# EasyEDA Pro project ComBadge.eprj

# Schematic Schematic1
Create Date: 2022-11-26; Page Name: P1; Project Name: ComBadge; Schematic Name: Schematic1; Update Date: 2022-11-29; Company: EasyEDA.com; Drawed: DanDan; Page Size: A4; Part Number: CMBG-01; Reviewed: DanDan; Version: V0.1a
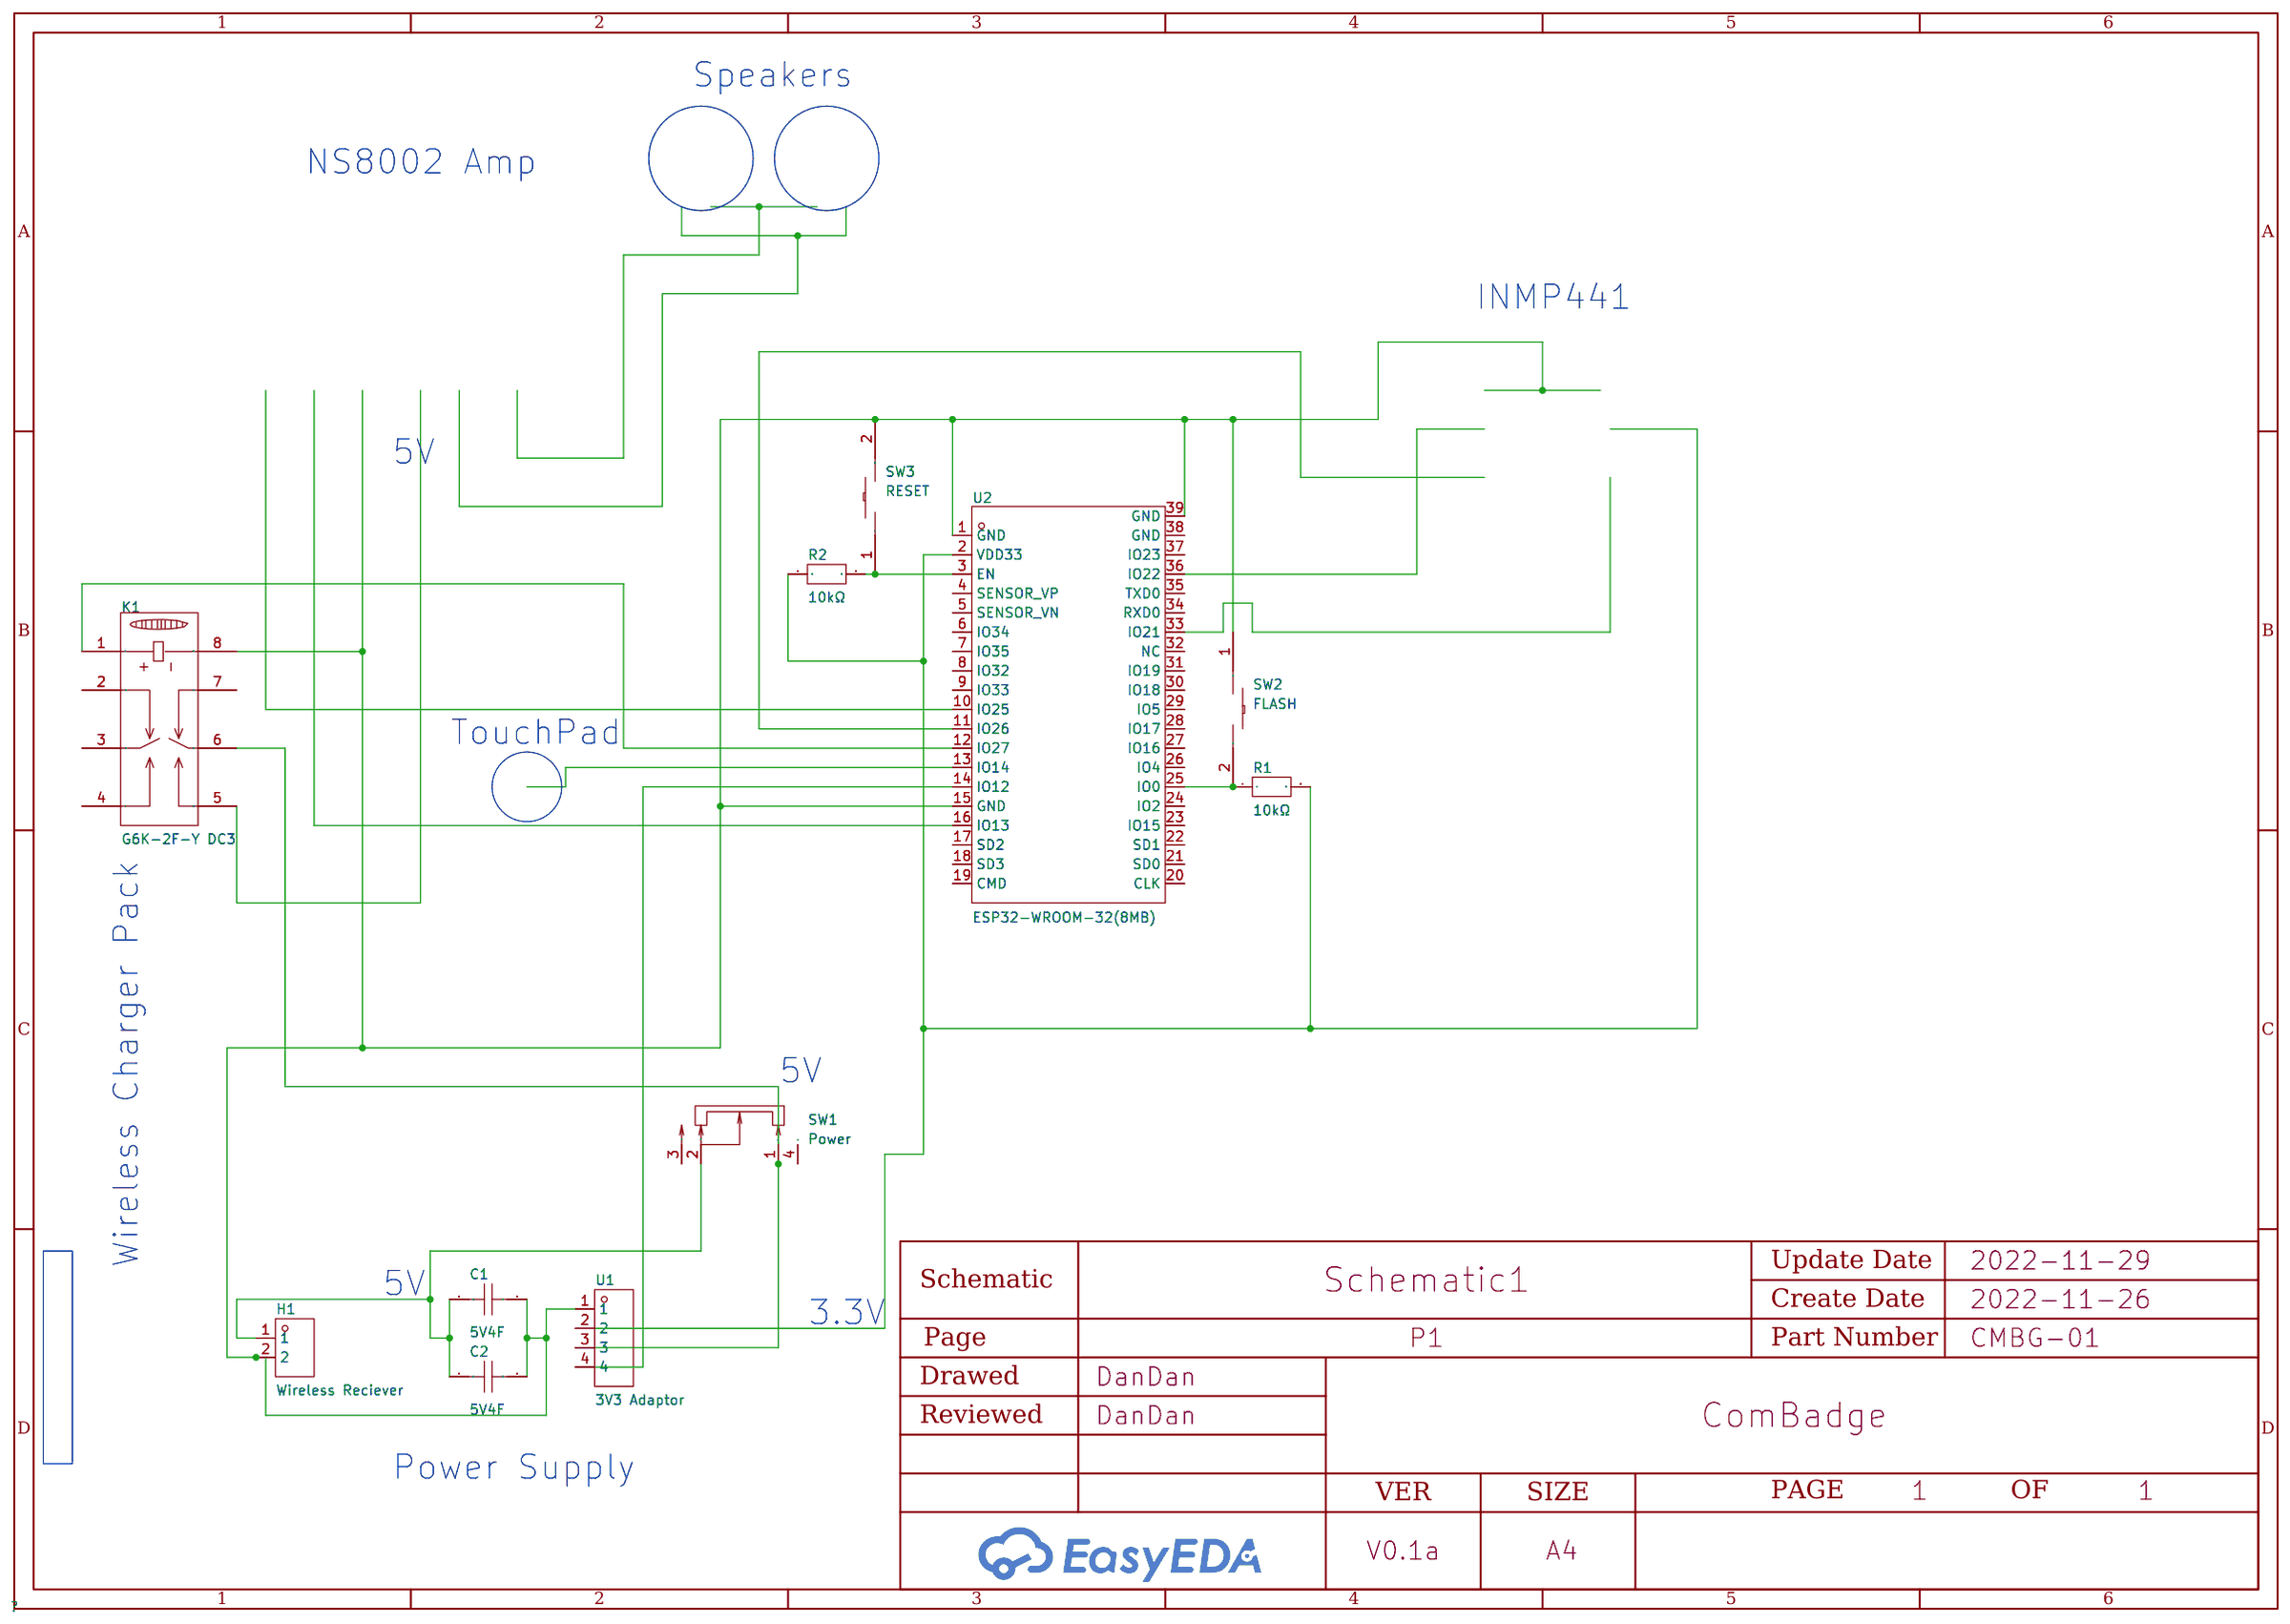
[diagram p0: schematic sheet]

## Parts
C1  4F  [C0805]
C2  100nF  [C0805]
H1  Wireless Reciever  [HDR-TH_2P-P2.00-V-M]
K1  G6K-2F-Y DC3  [RELAY-SMD_G6K-2F-Y]
R1  10kΩ  [R0402]
R2  10kΩ  [R0402]
SW1  Power  [SW-SMD_PCM12SMTR]
SW2  FLASH  [KEY-SMD_L4.0-W2.9-LS4.8]
SW3  RESET  [KEY-SMD_L4.0-W2.9-LS4.8]
U1  3V3 Adaptor  [CONN-TH_M2553R-04P]
U2  ESP32-WROOM-32(8MB)  [WIFIM-SMD_39P-L25.5-W18.0-P1.27]

## Library data of the parts
C1 C2 = CAP_0805: Supplier Footprint: 0805
H1 = MTP220-1102S1: Pitch:2mm Number of Pins:2 Number of Rows: Pin Structure:1x2P Row Spacing:- Mounting Type:Straight Circluar Pins/Square Pins:Square Pins Current Rating (Max):- Voltage Rating (Max):- Length of Mating Pin:4mm Insulation Height:2mm Length of End Connection; LCSC Part Name: 2mm 1x2P 直插 方针; Supplier Part: C376075; Manufacturer: MINTRON(明硕); Supplier Footprint: 插件,P=2mm; JLCPCB Part Class: Extended Part; Datasheet: https://atta.szlcsc.com/upload/public/pdf/source/20190320/C376075_C9D946476DF37AE707CF4A5E7AD237C9.pdf; Supplier: LCSC; Pitch: 2mm; Number of Pins: 2; Pin Structure: 1x2P; Mounting Type: Straight; Circluar Pins/Square Pins: Square Pins; Length of Mating Pin: 4mm; Insulation Height: 2mm; Length of End Connection Pin: 2.8mm; Operating Temperature Range: -40~+105; Color: Black
K1 = G6K-2F-Y DC3: Contact Form:DPDT Coil Type:Nolocking; LCSC Part Name: G6K-2F-Y 3VDC; Supplier Part: C93168; Manufacturer: OMRON(欧姆龙); Supplier Footprint: SMD-8; JLCPCB Part Class: Extended Part; Datasheet: https://atta.szlcsc.com/upload/public/pdf/source/20170308/1488942731996.pdf; Supplier: LCSC; Contact Form: DPDT; Coil Type: Nolocking
R1 R2 = SCR0402J10K: Resistance: Tolerance:±5% Tolerance:±5%; LCSC Part Name: 10kΩ ±5%; Supplier Part: C3017497; Manufacturer: VO(翔胜); Supplier Footprint: 0402; JLCPCB Part Class: Extended Part; Datasheet: https://atta.szlcsc.com/upload/public/pdf/source/20220513/247AF9639BA21CF93567DC289CCC6A22.pdf; Supplier: LCSC; Tolerance: ±5%
SW1 = PCM12SMTR: LCSC Part Name: 滑动开关 Slide Switch; Supplier Part: C221841; Manufacturer: C&K; Supplier Footprint: SMD; JLCPCB Part Class: Extended Part; Datasheet: https://atta.szlcsc.com/upload/public/pdf/source/20191010/C221841_0F1F9655E4FAFC7748E4E0C6F38AE098.pdf; Supplier: LCSC
SW2 SW3 = MPTFP2-V-T/R: Contact Current:50mA Voltage Rating (DC):12V Circuit:SPST Mounting Style:Brick nogging Actuator Style:Round Button With Lamp:- Switch Length:3.9mm Switch Width:2.9mm Switch Height:2mm; LCSC Part Name: 正按贴片; Supplier Part: C495942; Manufacturer: 台湾圜达; Supplier Footprint: SMD,2.9x3.9x2mm; JLCPCB Part Class: Extended Part; Datasheet: https://atta.szlcsc.com/upload/public/pdf/source/20180730/C240296_B51BC0E0CE19BD7A6B9D9AF5177A6E68.pdf; Supplier: LCSC; Contact Current: 50mA; Voltage Rating (DC): 12V; Circuit: SPST; Mounting Style: Brick nogging; Actuator Style: Round Button; Switch Length: 3.9mm; Switch Width: 2.9mm; Switch Height: 2mm
U1 = 杜邦2.54-4A弯针: LCSC Part Name: 2.54间距4p杜邦带锁弯针; Supplier Part: C469554; Manufacturer: BOOMELE(博穆精密); Supplier Footprint: 2.54  4P; JLCPCB Part Class: Extended Part; Datasheet: https://atta.szlcsc.comnull; Supplier: LCSC
U2 = ESP32-WROOM-32(8MB): Supplier Part: C529582; Manufacturer: ESPRESSIF(乐鑫); Supplier Footprint: Module; JLCPCB Part Class: Extended Part; Datasheet: https://atta.szlcsc.com/upload/public/pdf/source/20200521/C529581_8F7B9F041ADB7CF235FBC8D159B9C4FF.pdf; Supplier: LCSC

## Nets
Net-(C1-1): C1.1 C2.1 H1.2 K1.8 SW2.1 SW3.2 U1.1 U2.1(GND) U2.15(GND) U2.39(GND)
Net-(C1-2): C1.2 C2.2 H1.1 SW1.2
Net-(K1-1): K1.1 U2.12(IO27)
Net-(K1-6): K1.6 SW1.1 U1.3
Net-(R1-1): R1.1 SW2.2 U2.25(IO0)
Net-(R1-2): R1.2 R2.1 U1.2 U2.2(VDD33)
Net-(R2-2): R2.2 SW3.1 U2.3(EN)
Net-(U1-4): U1.4 U2.14(IO12)

Not connected (* = marked no-connect by the designer): K1 2 3 4 5 7; SW1 3 4; U2 4(SENSOR_VP) 5(SENSOR_VN) 6(IO34) 7(IO35) 8(IO32) 9(IO33) 10(IO25) 11(IO26) 13(IO14) 16(IO13) 17(SD2) 18(SD3) 19(CMD) 20(CLK) 21(SD0) 22(SD1) 23(IO15) 24(IO2) 26(IO4) 27(IO16) 28(IO17) 29(IO5) 30(IO18) 31(IO19) 32(NC) 33(IO21) 34(RXD0) 35(TXD0) 36(IO22) 37(IO23) 38(GND)

## Notes on the sheet
- Speakers
- NS8002 Amp
- INMP441
- 5V
- TouchPad
- 5V
- Wireless Charger Pack
- 5V
- 3.3V
- Power Supply

# Board ComBadge
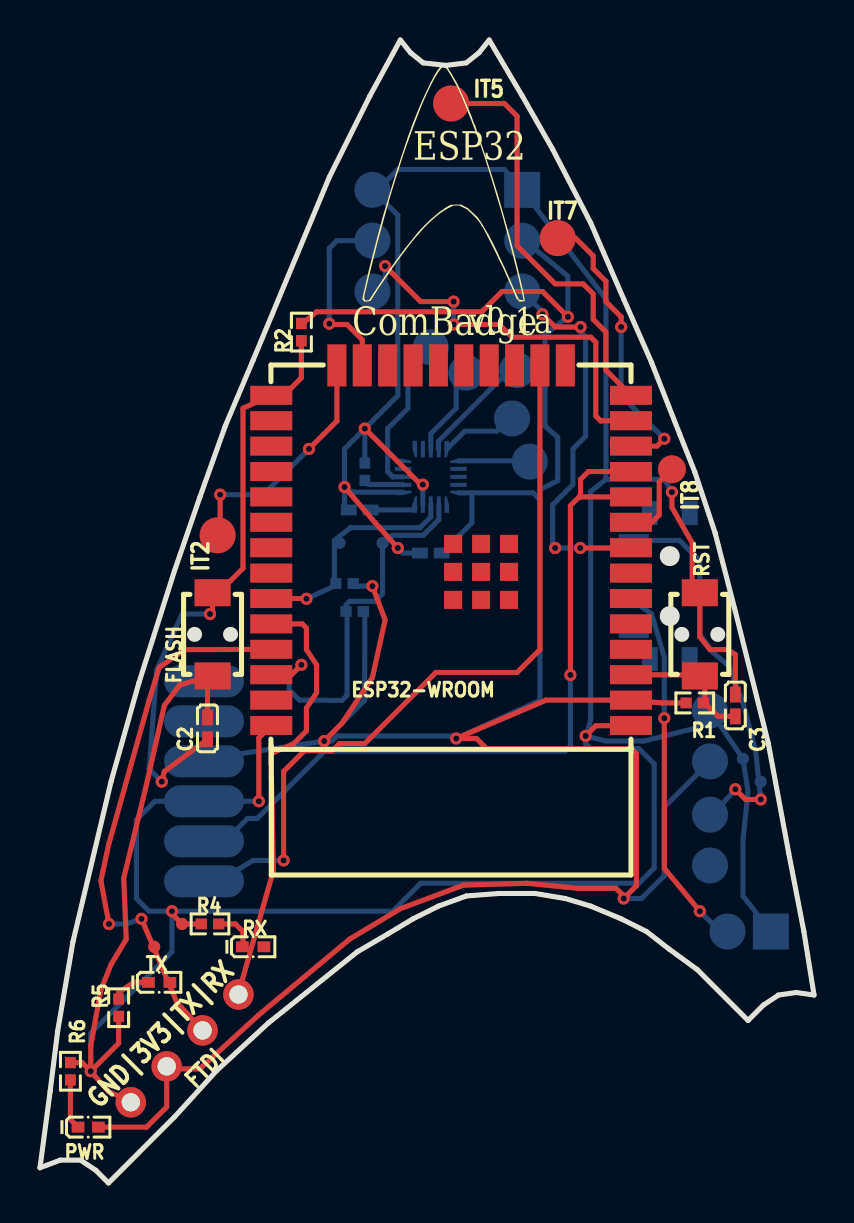
[diagram p1: board, top side]
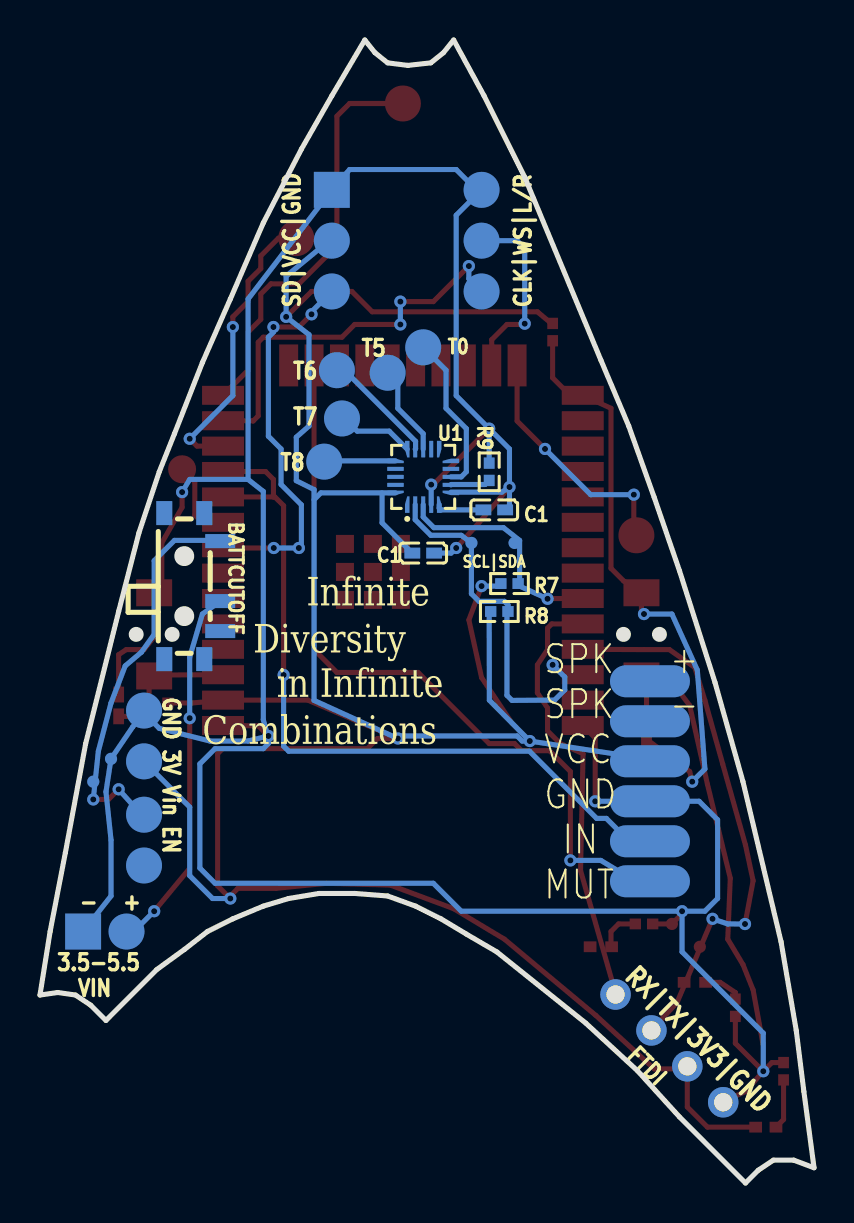
[diagram p2: board, bottom side, seen from below]

Outline 38.74 x 57.15 mm; copper layers: Top Layer, Bottom Layer. Coordinates in mm from the lower left corner of the outline.
Outline path: 0,0.76 1.02,1.14 2.03,1.14 2.79,0.64 3.43,0 6.73,3.3 8.83,5.61 11.43,8 15.88,11.56 17.4,12.45 18.67,13.21 19.94,13.84 21.34,14.35 22.99,14.48 24.77,14.48 26.29,14.22 27.56,13.84 29.08,13.21 30.35,12.57 31.5,11.68 32.89,10.67 35.43,8.13 36.2,8.89 36.96,9.4 37.85,9.53 38.74,9.4 38.23,12.57 37.47,16.51 36.45,21.97 34.8,28.58 33.78,32.51 32.77,35.56 32,37.47 30.61,41.02 29.21,44.2 27.56,48.01 25.65,51.69 24.13,54.36 22.48,57.15 21.97,56.52 21.34,56.01 20.32,55.88 19.18,56.01 18.54,56.52 18.03,57.15 16.51,54.36 14.48,50.29 10.67,41.15 9.27,37.85 8,34.29 6.73,30.61 4.95,25.02 3.56,20.07 1.65,12.07 0.89,7.62 0.51,4.57 0,0.76
Stack: Top Layer 0.035mm / Dielectric1 1.51mm FR4 er 4.5 / Bottom Layer 0.035mm

## Design rules (mm)
spacing safeClearance (default): track to track 0.152, other pairs 0.152 to 0.3
track width trackWidth (default): min 0.127, default 0.254, max 2.54
differential pair differentialPair (default): width min 0.127, default 0.254, max 2.54; gap min 0.152, default 0.152
via viaSize (default): diameter min 0.5, default 0.61, max 10; hole min 0.3, default 0.305, max 6

## Placement (name value [footprint] x y rotation side)
BATTCUTOFF  PCM12SMTR  [SW-SMD_PCM12SMTR]  31.12 29.85 270 bottom
C1  4F  [C0402]  19.56 31.5 180 bottom
C1#2  -  [C0402]  16 33.66 180 bottom
C2  100nF  [C0402_NEW]  8.38 22.73 90 top
C3  100nF  [C0402_NEW]  34.8 23.88 90 top
ESP32-WROOM  ESP32-WROOM-32E(8MB)  [WIFI-SMD_ESP32-WROOM-32E]  20.57 31.88 90 top
FLASH  MPTFP2-V-T/R  [KEY-SMD_L4.0-W2.9-LS4.8]  8.64 27.43 90 top
NOREF  -  [Pad_e63]  5.72 11.81 0 top
NOREF#2  -  [Pad_e23]  21.34 40.51 0 top
NOREF#3  -  [Pad_e554]  16.64 44.58 0 top
NOREF#4  -  [Pad_e79]  36.07 20.07 0 top
NOREF#5  -  [Pad_e325]  8.21 19.09 90 top
NOREF#6  -  [Pad_e307]  8.89 32.39 0 top
NOREF#7  -  [Pad_e116]  8.14 7.63 0 top
NOREF#8  -  [Pad_e72]  7.11 12.95 0 top
NOREF#9  -  [Pad_e552]  16.64 49.66 0 top
NOREF#10  -  [Pad_e52]  17.15 32 0 top
NOREF#11  -  [Pad_e327]  8.21 23.09 90 top
NOREF#12  -  [Pad_e423]  33.53 23.62 90 top
NOREF#13  -  [Pad_e305]  25.91 47.24 0 top
NOREF#14  -  [Pad_e429]  33.53 21.08 90 top
NOREF#15  -  [Pad_e324]  8.21 17.09 90 top
NOREF#16  -  [Pad_e464]  34.4 12.57 0 top
NOREF#17  -  [Pad_e326]  8.21 21.09 90 top
NOREF#18  -  [Pad_e549]  24.13 44.58 0 top
NOREF#19  -  [Pad_e117]  9.93 9.43 0 top
NOREF#20  -  [Pad_e426]  33.53 18.42 90 top
NOREF#21  -  [Pad_e54]  14.99 32 0 top
NOREF#22  -  [Pad_e427]  33.53 15.88 90 top
NOREF#23  -  [Pad_e22]  23.88 40.64 0 top
NOREF#24  -  [Pad_e17]  23.62 38.23 0 top
NOREF#25  -  [Pad_e548]  24.13 47.12 0 top
NOREF#26  -  [Pad_e547]  24.13 49.66 0 top
NOREF#27  -  [Pad_e85]  35.18 21.21 0 top
NOREF#28  -  [Pad_e16]  24.51 36.07 0 top
NOREF#29  -  [Pad_e463]  36.58 12.57 0 top
NOREF#30  -  [Pad_e551]  16.64 47.12 0 top
NOREF#31  -  [Pad_e312]  8.21 15.09 90 top
NOREF#32  -  [Pad_e306]  20.57 53.98 0 top
NOREF#33  -  [Pad_e113]  4.55 4.04 0 top
NOREF#34  -  [Pad_e24]  31.62 35.69 0 top
NOREF#35  -  [Pad_e328]  8.21 25.09 90 top
NOREF#36  -  [Pad_e114]  6.34 5.83 0 top
NOREF#37  -  [Pad_e231]  19.56 41.78 0 top
PWR  VLMS1500-GS08  [LED0402-RD_RED]  2.41 2.79 0 top
R1  10kΩ  [R0402]  32.77 24 0 top
R2  10kΩ  [R0402]  13.08 42.55 90 top
R4  -  [R0402]  8.51 12.95 0 top
R5  -  [R0402]  3.94 8.76 90 top
R6  -  [R0402]  1.52 5.59 90 top
R7  -  [R0402]  15.24 29.97 180 bottom
R8  -  [R0402]  15.75 28.58 180 bottom
R9  75kΩ  [R0402]  16.26 35.56 270 bottom
RST  MPTFP2-V-T/R  [KEY-SMD_L4.0-W2.9-LS4.8]  33.02 27.43 90 top
RX  VLMG1500-GS08  [LED0402-RD_GREEN]  10.67 11.81 0 top
TX  VLMG1500-GS08  [LED0402-RD_GREEN]  5.96 10.03 0 top
U1  3V3 Adaptor  [QFN-20_L3.0-W3.0-P0.40-BL]  19.56 35.31 180 bottom

## Footprints (pads in the part's own frame, mm; a bottom-side part is the same pattern mirrored in y, then rotated)
C0402
  rect 0.79x0.54 smd: 1(-0.545,0) 2(0.545,0)
C0402_NEW
  rect 0.79x0.54 smd: 1(-0.545,0) 2(0.545,0)
KEY-SMD_L4.0-W2.9-LS4.8
  rect 1.35x1.8 smd: 1(-2.08,0) 2(2.08,0)
LED0402-RD_GREEN
  rect 0.636x0.54 smd: 1(-0.538,0) 2(0.538,0)
LED0402-RD_RED
  rect 0.636x0.54 smd: 1(-0.508,0) 2(0.508,0)
Pad_e16
  round 1.8 smd far side: 8(0,0)
Pad_e17
  round 1.8 smd far side: 7(0,0)
Pad_e22
  round 1.8 smd far side: 6(0,0)
Pad_e23
  round 1.8 smd far side: 5(0,0)
Pad_e24
  round 1.4 smd: 8(0,0)
Pad_e52
  round 0.61 smd far side: TP1(0,0)
Pad_e54
  round 0.61 smd far side: TP2(0,0)
Pad_e63
  round 0.61 smd: TP4(0,0)
Pad_e72
  round 0.61 smd: TP5(0,0)
Pad_e79
  round 0.61 smd far side: TP7(0,0)
Pad_e85
  round 0.61 smd far side: TP8(0,0)
Pad_e113
  round 1.524 hole 0.914: 2(0,0)
Pad_e114
  round 1.524 hole 0.914: 4(0,0)
Pad_e116
  round 1.524 hole 0.914: 5(0,0)
Pad_e117
  round 1.524 hole 0.914: 6(0,0)
Pad_e231
  round 1.8 smd far side: 0(0,0)
Pad_e305
  round 1.8 smd: 7(0,0)
Pad_e306
  round 1.8 smd: 5(0,0)
Pad_e307
  round 1.8 smd: 2(0,0)
Pad_e312
  oval 1.6x4 smd far side: 1(0,0)
Pad_e324
  oval 1.6x4 smd far side: 2(0,0)
Pad_e325
  oval 1.6x4 smd far side: 3(0,0)
Pad_e326
  oval 1.6x4 smd far side: 4(0,0)
Pad_e327
  oval 1.6x4 smd far side: 5(0,0)
Pad_e328
  oval 1.6x4 smd far side: 6(0,0)
Pad_e423
  round 1.8 smd far side: 2(0,0)
Pad_e426
  round 1.8 smd far side: 5(0,0)
Pad_e427
  round 1.8 smd far side: 6(0,0)
Pad_e429
  round 1.8 smd far side: 3(0,0)
Pad_e463
  rect 1.8x1.8 smd far side: 8(0,0)
Pad_e464
  round 1.8 smd far side: 9(0,0)
Pad_e547
  rect 1.8x1.8 smd far side: 1(0,0)
Pad_e548
  round 1.8 smd far side: 2(0,0)
Pad_e549
  round 1.8 smd far side: 3(0,0)
Pad_e551
  round 1.8 smd far side: 5(0,0)
Pad_e552
  round 1.8 smd far side: 6(0,0)
Pad_e554
  round 1.8 smd far side: 4(0,0)
QFN-20_L3.0-W3.0-P0.40-BL
  custom 0.224x0.825 smd: 1(-0.8,-1.387) 5(0.8,-1.387) 11(0.8,1.387) 15(-0.8,1.387)
  rect 0.2x0.825 smd: 2(-0.4,-1.387) 3(0,-1.387) 4(0.4,-1.387) 12(0.4,1.387) 13(0,1.387) 14(-0.4,1.387)
  custom 0.825x0.224 smd: 6(1.387,-0.8) 10(1.387,0.8) 16(-1.387,0.8) 20(-1.387,-0.8)
  rect 0.825x0.2 smd: 7(1.387,-0.4) 8(1.387,0) 9(1.387,0.4) 17(-1.387,0.4) 18(-1.387,0) 19(-1.387,-0.4)
R0402
  rect 0.566x0.54 smd: 1(-0.433,0) 2(0.433,0)
SW-SMD_PCM12SMTR
  rect 0.7x1.5 smd: 1(-2.25,1.4) 2(0.75,1.4) 3(2.25,1.4)
  rect 1.2x0.8 smd: 4(-3.65,-1.4) 4(-3.65,0.6) 4(3.65,-1.4) 4(3.65,0.6)
WIFI-SMD_ESP32-WROOM-32E
  rect 0.95x2.1 smd: 1(-9.002,-9) 2(-7.732,-9) 3(-6.463,-9) 4(-5.192,-9) 5(-3.922,-9) 6(-2.652,-9) 7(-1.383,-9) 8(-0.113,-9) 9(1.157,-9) 10(2.428,-9) 11(3.697,-9) 12(4.968,-9) 13(6.237,-9) 14(7.508,-9) 25(7.508,9) 26(6.237,9) 27(4.968,9) 28(3.697,9) 29(2.428,9) 30(1.157,9) 31(-0.113,9) 32(-1.383,9) 33(-2.652,9) 34(-3.922,9) 35(-5.192,9) 36(-6.463,9) 37(-7.732,9) 38(-9.002,9)
  rect 2.1x0.95 smd: 15(9.002,-5.715) 16(9.002,-4.445) 17(9.002,-3.175) 18(9.002,-1.905) 19(9.002,-0.635) 20(9.002,0.635) 21(9.002,1.905) 22(9.002,3.175) 23(9.002,4.445) 24(9.002,5.715)
  rect 0.9x0.9 smd: 39(-2.721,-0.1) 39(-2.721,-1.5) 39(-2.721,-2.9) 39(-1.321,-0.1) 39(-1.321,-1.5) 39(-1.321,-2.9) 39(0.079,-0.1) 39(0.079,-1.5) 39(0.079,-2.9)

## Nets
As in the schematic.

Pads without a net: BATTCUTOFF 1 2 3 4; C1 1 2; C1#2 1 2; C2 1 2; C3 1 2; ESP32-WROOM 1 2 3 4 5 6 7 8 9 10 11 12 13 14 15 16 17 18 19 20 21 22 23 24 25 26 27 28 29 30 31 32 33 34 35 36 37 38 39; FLASH 1 2; NOREF TP4; NOREF#2 5; NOREF#3 4; NOREF#4 TP7; NOREF#5 3; NOREF#6 2; NOREF#7 5; NOREF#8 TP5; NOREF#9 6; NOREF#10 TP1; NOREF#11 5; NOREF#12 2; NOREF#13 7; NOREF#14 3; NOREF#15 2; NOREF#16 9; NOREF#17 4; NOREF#18 3; NOREF#19 6; NOREF#20 5; NOREF#21 TP2; NOREF#22 6; NOREF#23 6; NOREF#24 7; NOREF#25 2; NOREF#26 1; NOREF#27 TP8; NOREF#28 8; NOREF#29 8; NOREF#30 5; NOREF#31 1; NOREF#32 5; NOREF#33 2; NOREF#34 8; NOREF#35 6; NOREF#36 4; NOREF#37 0; PWR 1 2; R1 1 2; R2 1 2; R4 1 2; R5 1 2; R6 1 2; R7 1 2; R8 1 2; R9 1 2; RST 1 2; RX 1 2; TX 1 2; U1 1 2 3 4 5 6 7 8 9 10 11 12 13 14 15 16 17 18 19 20

## Via types
v1: diameter 0.61, hole 0.305, Top Layer to Bottom Layer, 38 vias

## Routing (per net, layer and track width the routed paths; a pad name or vN(x,y) marks a point on that pad's centre or on a via; arc(x,y) is an arc through that point)
(no net): length 274.9
  Top Layer w0.254: NOREF#32.5 23.24,53.98 23.88,53.34 23.88,46.86 25.78,44.96 27.18,44.96 27.69,44.45 27.69,43.18 28.32,42.55 28.32,40.64 ESP32-WROOM.14 ; v1(19.16,34.92) 19.06,34.92 v1(16.26,37.72) ; v1(14.48,42.97) 14.52,42.93 15.37,42.93 16.13,42.16 ESP32-WROOM.23 ; ESP32-WROOM.24 14.86,38.1 v1(13.46,36.7) ; NOREF#6.2 8.89,33.02 9.02,33.15 v1(9.02,34.42) ; ESP32-WROOM.12 30.88,36.84 31.12,37.08 ; 26.42,47.24 26.8,47.24 27.69,46.36 27.69,45.72 28.32,45.09 28.32,44.07 29.08,43.31 v1(29.08,42.8) ; v1(20.83,22.23) 21.84,22.23 22.35,21.72 29.59,21.72 29.84,21.46 29.84,14.86 v1(29.21,14.22) 29.21,14.35 28.83,14.73 26.92,14.73 ; v1(20.7,42.93) 22.99,42.93 23.62,42.29 27.56,42.29 27.81,42.04 27.81,38.35 28.07,38.1 28.08,38.11 ESP32-WROOM.13 ; 23.88,25.53 19.81,25.53 16.26,21.97 14.99,21.97 14.63,21.62 13.23,21.62 12.19,20.57 v1(12.19,16.13) ; v1(25.15,43.43) 25.78,42.8 v1(27.05,42.8) ; 31.37,35.43 30.99,35.05 30.99,33.4 30.62,33.03 ESP32-WROOM.9 ; v1(27.03,31.75) 29.56,31.75 ESP32-WROOM.8 ; v1(20.7,44.07) 19.05,44.07 v1(17.27,45.85) ; ESP32-WROOM.11 27.45,35.57 27.05,35.18 27.05,34.29
  Bottom Layer w0.254: v1(29.08,42.8) 29.08,39.37 v1(31.24,37.21) ; v1(9.02,34.42) 11.18,34.42 v1(13.46,36.7) ; NOREF#3.4 17.27,45.21 v1(17.27,45.85) ; NOREF#18.3 25.15,43.56 v1(25.15,43.43) ; NOREF#28.8 24.47,36.11 U1.16 ; U1.8 17.65,35.31 17.4,35.56 17.4,37.72 18.42,38.74 18.42,40.64 NOREF#37.0 ; R9.2 16.46,34.93 18.15,34.93 U1.7 ; C1#2.2 15.24,33.87 v1(15.24,34.8) ; 21.34,40.39 20.83,39.88 20.83,38.74 19.56,37.47 U1.13 ; v1(14.22,22.1) 14.61,22.1 14.86,22.35 20.7,22.35 v1(20.83,22.23) ; R8.2 15.31,28.9 15.49,29.08 16.76,29.08 17.15,29.46 ; v1(26.54,25.4) 26.54,21.84 26.29,21.59 14.24,21.59 10.88,18.23 10.39,18.23 9.25,17.09 NOREF#15.2 ; 23.75,38.48 22.86,37.59 21.26,37.59 U1.15 ; NOREF#23.6 23.62,40.39 23.24,40.39 19.94,37.08 19.94,36.71 U1.14 ; v1(6.6,13.59) 5.46,13.59 4.83,14.22 4.83,18.16 5.75,19.09 NOREF#5.3 ; v1(6.6,13.59) 17.65,13.59 19.05,14.99 29.97,14.99 30.73,15.75 30.73,20.96 29.97,21.72 27.56,21.72 27.31,21.97 v1(27.31,22.35) ; v1(6.6,13.59) 6.6,11.56 2.54,7.49 v1(2.54,5.59) ; C1#2.1 18.67,33.66 18.76,33.74 U1.5 ; NOREF#30.5 14.86,47.12 14.48,46.74 v1(14.48,42.97) ; v1(27.05,42.8) 27.05,42.55 27.31,42.29 27.31,37.34 26.67,36.7 26.67,34.93 25.65,33.91 25.65,31.88 v1(25.78,31.75) v1(27.03,31.75) ; R9.1 v1(16.26,37.72) ; v1(20.7,42.93) v1(20.7,44.07) ; v1(29.21,14.22) 30.1,14.22 31.24,15.37 31.24,18.8 NOREF#14.3 ; U1.4 v1(19.16,34.92)
  vias: v1(3.45,12.95) v1(5.08,13.21) v1(6.1,20.07) v1(8.51,28.45) v1(10.95,19.09) v1(13.08,25.91) v1(13.34,29.21) v1(16.64,29.85) v1(17.91,31.75) v1(26.42,43.31) v1(31.24,23.24) v1(31.62,34.54) v1(33.02,13.59) v1(34.8,19.69) v1(36.07,19.18)

## Text on the board
Bottom Silkscreen Layer: SCL|SDA | T0 | GND 3V Vin EN | CLK|WS|L/R | SD|VCC|GND | T5 | T6 | T7 | T8 | + | - | 3.5-5.5 / VIN | FTDI | RX|TX|3V3|GND | SPK   + / SPK   - / VCC / GND / IN / MUT | Infinite / Diversity | in Infinite / Combinations
Document Layer: 3v3 / Regulator | INMP441 | NS8002
Top Silkscreen Layer: IT5 | IT7 | FTDI | IT2 | IT8 | GND|3V3|TX|RX | v0.1a | ComBadge | ESP32

# Board TP4050x Lipo-Charger
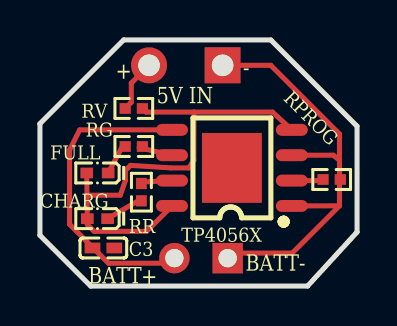
[diagram p3: board, top side]
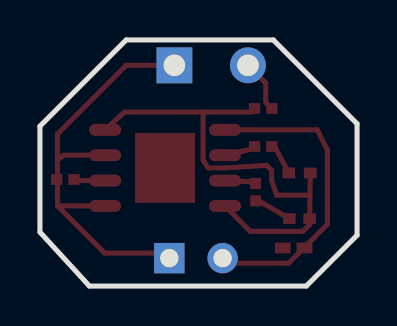
[diagram p4: board, bottom side, seen from below]

Outline 15.88 x 12.32 mm; copper layers: Top Layer, Bottom Layer. Coordinates in mm from the lower left corner of the outline.
Outline path: 0,8.13 4.19,12.32 11.56,12.32 15.88,8 15.88,2.7 13.4,0 2.54,0 0,2.54 0,8.13
Stack: Top Layer 0.035mm / Dielectric1 1.51mm FR4 er 4.5 / Bottom Layer 0.035mm

## Design rules (mm)
template: JLCPCB Capability(Two Layers Board)
spacing copperThickness1oz (default): track to track 0.102, other pairs 0.152 to 0.3
spacing copperThickness2oz: track to track 0.203, other pairs 0.152 to 0.3
track width copperThickness1oz (default): min 0.127, default 0.254, max 2.54
track width copperThickness2oz: min 0.203, default 0.254, max 2.54
differential pair differentialPair (default): width min 0.127, default 0.254, max 2.54; gap min 0.152, default 0.152
via viaSize (default): diameter min 0.5, default 0.61, max 10; hole min 0.3, default 0.305, max 6.3

## Placement (name value [footprint] x y rotation side)
C3  10uF  [C0402_NEW]  3.17 1.91 0 top
CHARG  VLMS1500-GS08  [LED0402-RD_RED]  2.88 3.37 180 top
FULL  VLMG1500-GS08  [LED0402-RD_GREEN]  2.88 5.66 180 top
NOREF  -  [Pad_e36]  5.46 11.05 90 top
NOREF#2  -  [Pad_e88]  6.73 1.4 0 top
NOREF#3  -  [Pad_e21]  9.14 11.05 0 top
NOREF#4  -  [Pad_e89]  9.4 1.4 0 top
RG  1kΩ  [R0402]  4.7 6.98 180 top
RPROG  2kΩ  [R0402]  14.6 5.33 0 top
RR  1kΩ  [R0402]  5.08 4.7 90 top
RV  0.4Ω  [R0402]  4.7 8.89 180 top
TP4056X  TP4056X-42-ESOP8  [SOP-8_L4.9-W3.9-P1.27-LS6.0-TL-EP]  9.61 5.91 180 top

## Footprints (pads in the part's own frame, mm; a bottom-side part is the same pattern mirrored in y, then rotated)
C0402_NEW
  rect 0.79x0.54 smd: 1(-0.545,0) 2(0.545,0)
LED0402-RD_GREEN
  rect 0.636x0.54 smd: 1(-0.538,0) 2(0.538,0)
LED0402-RD_RED
  rect 0.636x0.54 smd: 1(-0.508,0) 2(0.508,0)
Pad_e21
  rect 1.8x1.8 hole 1.08: 5VIN(0,0)
Pad_e36
  round 1.8 hole 1.08: 5VIN(0,0)
Pad_e88
  round 1.524 hole 0.914: BATTPOS(0,0)
Pad_e89
  rect 1.524x1.524 hole 0.914: BATTGND(0,0)
R0402
  rect 0.566x0.54 smd: 1(-0.433,0) 2(0.433,0)
SOP-8_L4.9-W3.9-P1.27-LS6.0-TL-EP
  oval 1.6x0.6 smd: 1(-3,1.905) 2(-3,0.635) 3(-3,-0.635) 4(-3,-1.905) 5(3,-1.905) 6(3,-0.635) 7(3,0.635) 8(3,1.905)
  rect 3x3.5 smd: 9(0,0)

## Nets

Pads without a net: C3 1 2; CHARG 1 2; FULL 1 2; NOREF 5VIN; NOREF#2 BATTPOS; NOREF#3 5VIN; NOREF#4 BATTGND; RG 1 2; RPROG 1 2; RR 1 2; RV 1 2; TP4056X 1 2 3 4 5 6 7 8 9

## Routing (per net, layer and track width the routed paths; a pad name or vN(x,y) marks a point on that pad's centre or on a via; arc(x,y) is an arc through that point)
(no net): length 73.5
  Top Layer w0.254: 6.73,1.65 NOREF#2.BATTPOS 6.48,1.14 3.43,1.14 1.48,3.09 1.48,6.8 1.99,7.82 TP4056X.5 ; 4.1,6.93 3.42,5.66 ; 2.36,4.55 4.02,4.55 4.28,5.28 4.28,5.79 4.53,6.04 6.56,5.91 7.45,5.91 7.71,6.3 7.71,8.71 ; 2.36,4.55 CHARG.2 2.37,3.08 2.71,2.74 5.34,2.74 TP4056X.8 ; 2.36,4.55 FULL.2 ; 15,4.02 12.63,1.65 9.4,1.65 ; 15,4.02 TP4056X.1 ; 15,4.02 15,6.3 ; NOREF#3.5VIN 11.56,11.05 15,7.61 15,6.3 ; 14.13,5.28 TP4056X.2 ; TP4056X.6 4.96,6.93 ; 15,6.3 14.69,6.55 TP4056X.3 ; RV.2 4.57,9.2 4.57,10.16 NOREF.5VIN ; 5.04,4.34 CHARG.1 ; TP4056X.7 5.04,5.2 ; 7.71,8.71 5.31,8.71 RV.1 ; 7.71,8.71 11.64,8.71 TP4056X.4

## Text on the board
Top Silkscreen Layer: BATT+ | + | 5V IN | - | BATT-
